# Altium project bridgeplusC.PrjPcb
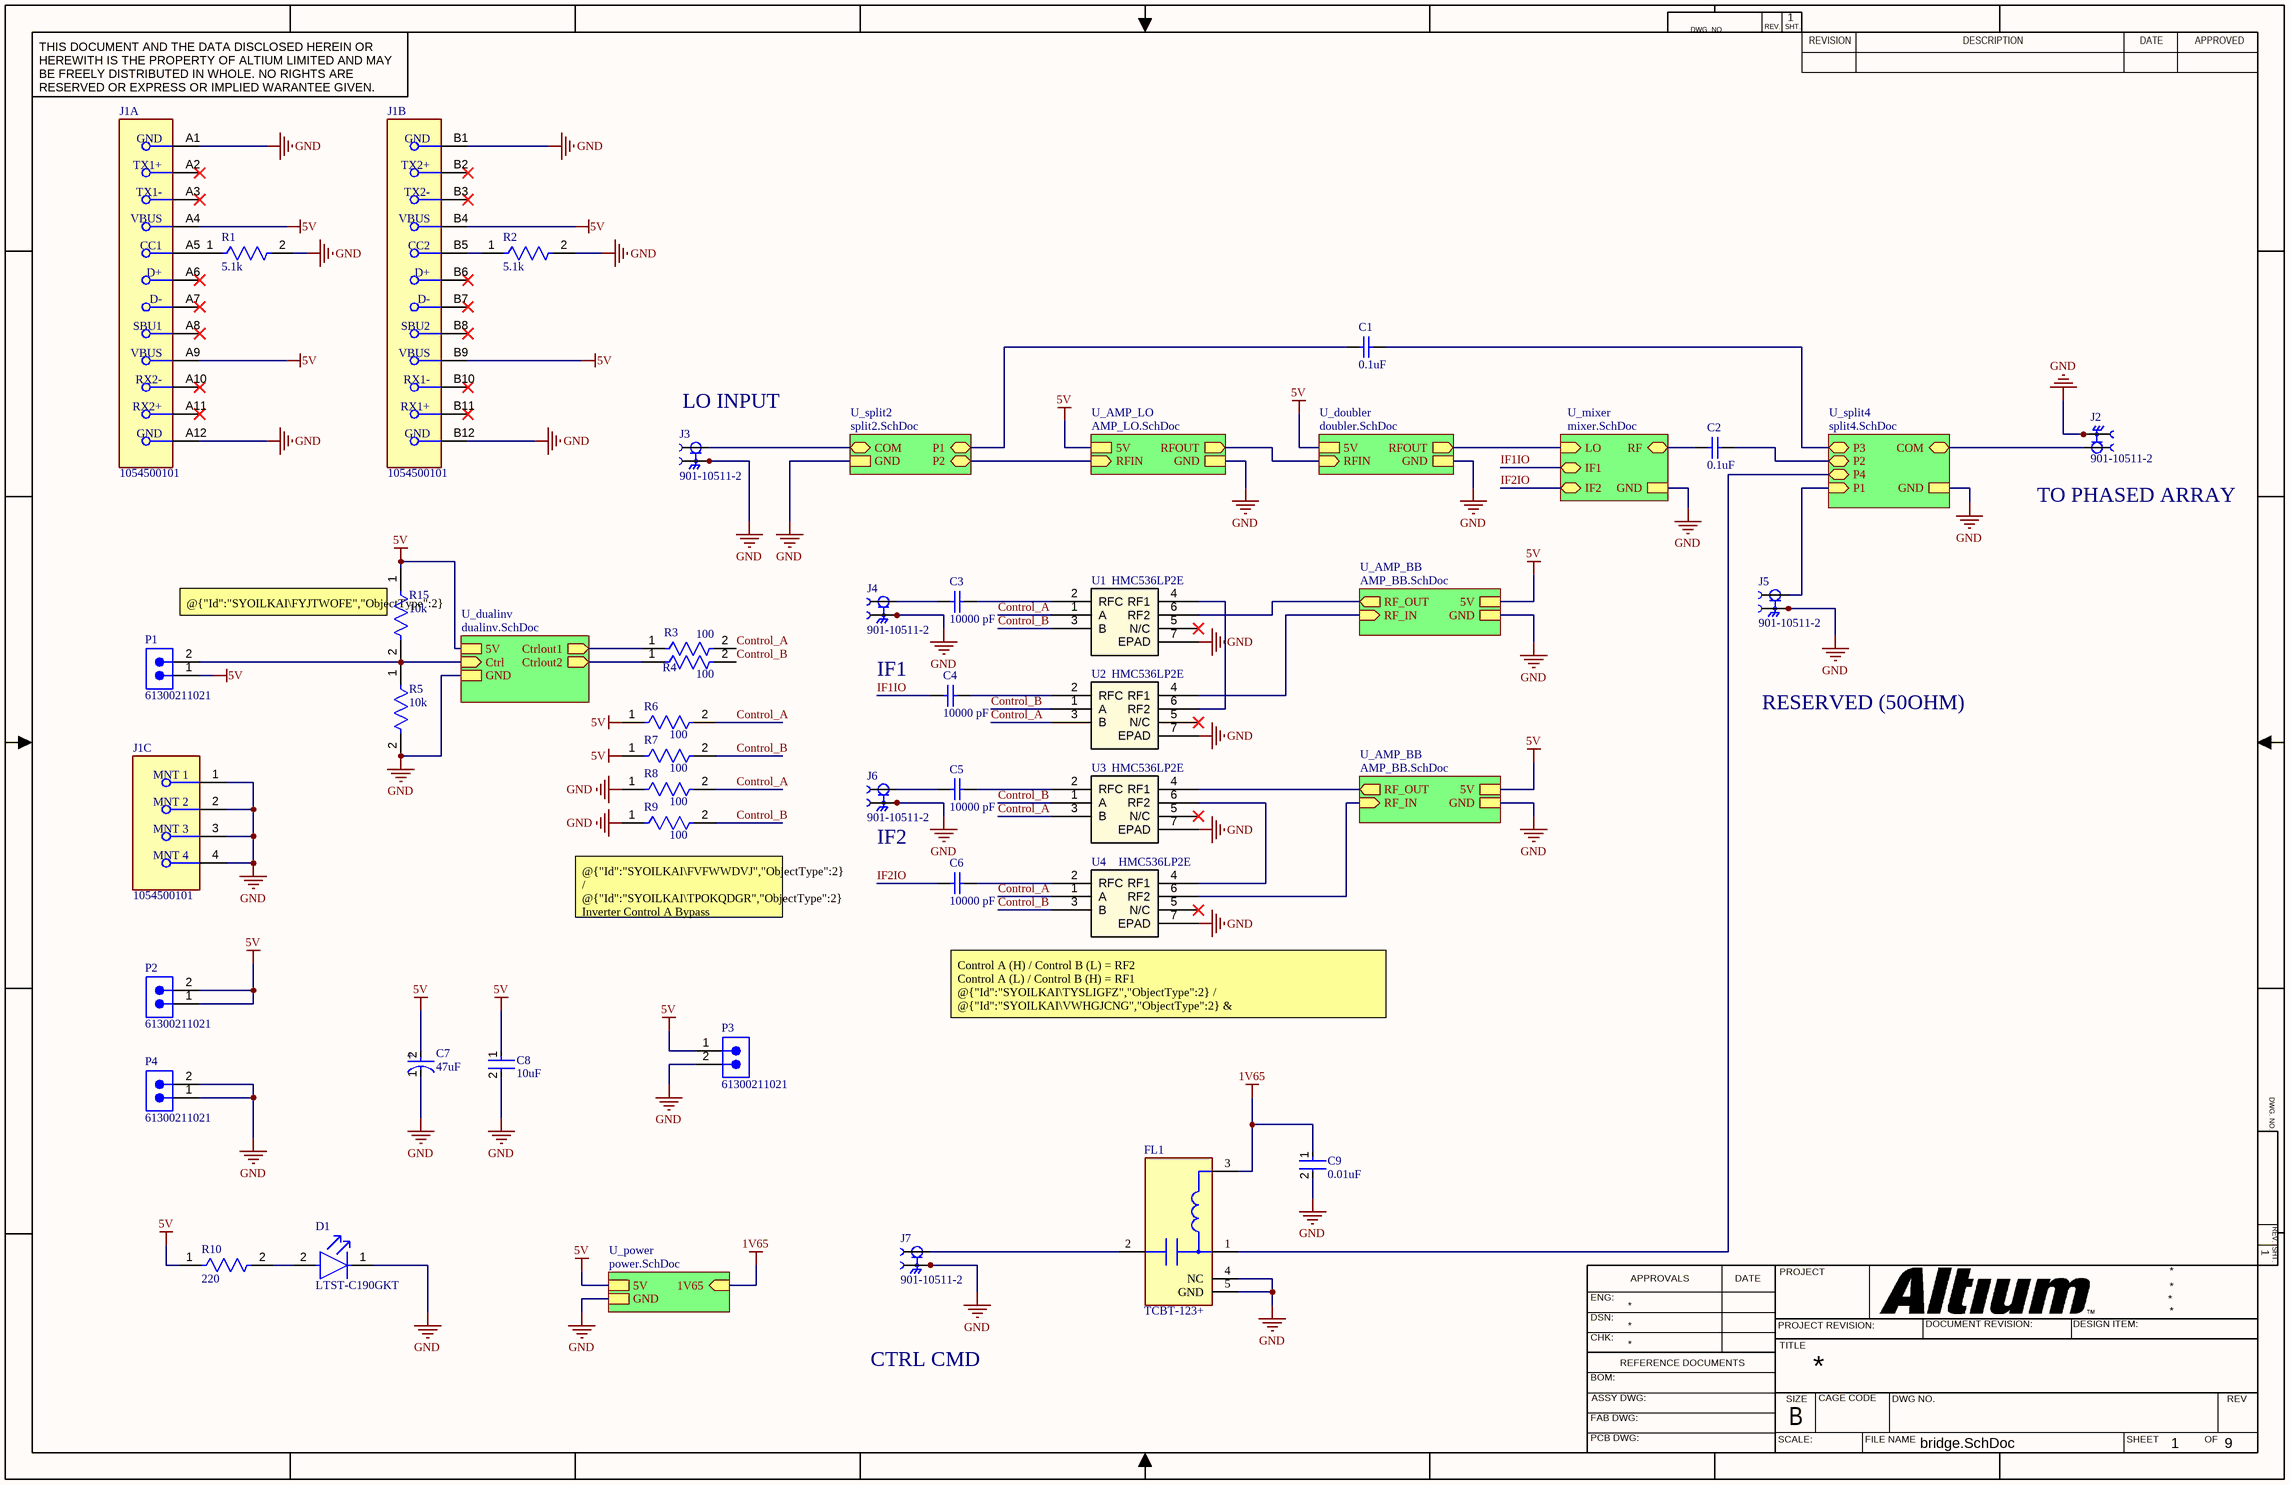
[diagram p0: bridge.SchDoc]
9 sheets, 75 parts. Net scope: strictly hierarchical (ports join the sheet entries above them; power ports are local).
Board file: BridgeC.PcbDoc
Sheets:
  bridge.SchDoc
    U_split2 = split2.SchDoc
    U_mixer = mixer.SchDoc
    U_split4 = split4.SchDoc
    U_AMP_LO = AMP_LO.SchDoc
    U_doubler = doubler.SchDoc
    U_power = power.SchDoc
    U_dualinv = dualinv.SchDoc
    U_AMP_BB = AMP_BB.SchDoc
    U_AMP_BB = AMP_BB.SchDoc

## Sheet bridge.SchDoc
size 431 x 279 mm; SheetNumber: 1; SheetTotal: 9

### Parts
C1  0.1uF  [CAPC0603X33X15LL03T05]
C2  0.1uF  [CAPC0603X33X15LL03T05]
C3  10000 pF  [CAPC1005X55X25ML05T10]
C4  10000 pF  [CAPC1005X55X25ML05T10]
C5  10000 pF  [CAPC1005X55X25ML05T10]
C6  10000 pF  [CAPC1005X55X25ML05T10]
C7  47uF  [FP-TAJB-MFG]
C8  10uF  [FP-ZRB18AR61E106ME01L-MFG]
C9  0.01uF  [FP-C0402-BB-MFG]
D1  LTST-C190GKT  [FP-LTST-C190GKT-MFG]
FL1  TCBT-123+  [FP-GU1414-MFG]
J1  1054500101  [FP-1054500101-MFG]  (parts A,B,C of 3)
J2  901-10511-2  [AMPHENOL_901-10511-2]
J3  901-10511-2  [AMPHENOL_901-10511-2]
J4  901-10511-2  [AMPHENOL_901-10511-2]
J5  901-10511-2  [AMPHENOL_901-10511-2]
J6  901-10511-2  [AMPHENOL_901-10511-2]
J7  901-10511-2  [AMPHENOL_901-10511-2]
P1  61300211021  [61300211021]
P2  61300211021  [61300211021]
P3  61300211021  [61300211021]
P4  61300211021  [61300211021]
R1  5.1k  [FP-CRCW0603-e3-IPC_C]
R2  5.1k  [FP-CRCW0603-e3-IPC_C]
R3  100  [FP-RC0603-0_55-MFG]
R4  100  [FP-RC0603-0_55-MFG]
R5  10k  [FP-RC0603-0_55-IPC_C]
R6  100  [FP-RC0603-0_55-MFG]
R7  100  [FP-RC0603-0_55-MFG]
R8  100  [FP-RC0603-0_55-MFG]
R9  100  [FP-RC0603-0_55-MFG]
R10  220  [FP-ERJ3G-MFG]
R15  10k  [FP-RC0603-0_55-IPC_C]
U1  HMC536LP2E  [HMC536LP2E]
U2  HMC536LP2E  [HMC536LP2E]
U3  HMC536LP2E  [HMC536LP2E]
U4  HMC536LP2E  [HMC536LP2E]

### Sub-sheets
U_AMP_BB = AMP_BB.SchDoc: RF_OUT (out), RF_IN (in), 5V, GND
U_AMP_BB = AMP_BB.SchDoc: RF_OUT (out), RF_IN (in), 5V, GND
U_AMP_LO = AMP_LO.SchDoc: GND, 5V, RFIN (in), RFOUT (out)
U_doubler = doubler.SchDoc: RFOUT (out), RFIN (in), GND, 5V
U_dualinv = dualinv.SchDoc: Ctrl (in), 5V, GND, Ctrlout1 (out), Ctrlout2 (out)
U_mixer = mixer.SchDoc: RF (bidir), GND, LO (in), IF1 (bidir), IF2 (bidir)
U_power = power.SchDoc: 5V, GND, 1V65 (in)
U_split2 = split2.SchDoc: COM (bidir), P1 (bidir), P2 (bidir), GND
U_split4 = split4.SchDoc: GND, P1 (in), P2 (bidir), P3 (bidir), P4 (bidir), COM (bidir)

### Nets
1V65: C9.1 FL1.3(DC) ; sheet U_power/1V65
5V: C7.2(A) C8.1 J1.A4(VBUS) J1.A9(VBUS) J1.B4(VBUS) J1.B9(VBUS) P1.1 P2.1 P2.2 P3.1 R6.1 R7.1 R10.1 R15.1 ; sheet U_AMP_LO/5V, sheet U_doubler/5V, sheet U_power/5V, sheet U_dualinv/5V, sheet U_AMP_BB/5V, sheet U_AMP_BB/5V  [project net +5]
GND: C7.1(C) C8.2 C9.2 D1.1(C) FL1.4(NC) FL1.5(GND) J1.1(MNT_1) J1.2(MNT_2) J1.3(MNT_3) J1.4(MNT_4) J1.A1(GND) J1.A12(GND) J1.B1(GND) J1.B12(GND) J2.G1 J2.G2 J3.G1 J3.G2 J4.G1 J4.G2 J5.G1 J5.G2 J6.G1 J6.G2 J7.G1 J7.G2 P3.2 P4.1 P4.2 R1.2 R2.2 R5.2 R8.1 R9.1 U1.7(EPAD) U2.7(EPAD) U3.7(EPAD) U4.7(EPAD) ; sheet U_split2/GND, sheet U_mixer/GND, sheet U_split4/GND, sheet U_AMP_LO/GND, sheet U_doubler/GND, sheet U_power/GND, sheet U_dualinv/GND, sheet U_AMP_BB/GND, sheet U_AMP_BB/GND
Control_A: R3.2 R6.2 R8.2 U1.1(A) U2.3(B) U3.3(B) U4.1(A)
Control_B: R4.2 R7.2 R9.2 U1.3(B) U2.1(A) U3.1(A) U4.3(B)
IF1IO: C4.1 ; sheet U_mixer/IF1
IF2IO: C6.1 ; sheet U_mixer/IF2
NetC1_1: C1.1 ; sheet U_split2/P1
NetC1_2: C1.2 ; sheet U_split4/P3
NetC2_1: C2.1 ; sheet U_mixer/RF
NetC2_2: C2.2 ; sheet U_split4/P2
NetC3_1: C3.1 J4.1
NetC3_2: C3.2 U1.2(RFC)
NetC4_2: C4.2 U2.2(RFC)
NetC5_1: C5.1 J6.1
NetC5_2: C5.2 U3.2(RFC)
NetC6_2: C6.2 U4.2(RFC)
NetC20_2: sheet U_AMP_LO/RFOUT, sheet U_doubler/RFIN
NetC23A_1: U2.4(RF1) ; sheet U_AMP_BB/RF_IN
NetC23B_1: U4.6(RF2) ; sheet U_AMP_BB/RF_IN
NetC24A_2: U1.6(RF2) ; sheet U_AMP_BB/RF_OUT
NetC24B_2: U3.4(RF1) ; sheet U_AMP_BB/RF_OUT
NetD1_2: D1.2(A) R10.2
NetFL1_1: FL1.1(RF&DC) ; sheet U_split4/P4
NetFL1_2: FL1.2(RF) J7.1
NetJ1_A5: J1.A5(CC1) R1.1
NetJ1_B5: J1.B5(CC2) R2.1
NetJ2_1: J2.1 ; sheet U_split4/COM
NetJ3_1: J3.1 ; sheet U_split2/COM
NetJ5_1: J5.1 ; sheet U_split4/P1
NetL2_1: sheet U_split2/P2, sheet U_AMP_LO/RFIN
NetP1_2: P1.2 R5.1 R15.2 ; sheet U_dualinv/Ctrl
NetR3_1: R3.1 ; sheet U_dualinv/Ctrlout1
NetR4_1: R4.1 ; sheet U_dualinv/Ctrlout2
NetU1_4: U1.4(RF1) U2.6(RF2)
NetU3_6: U3.6(RF2) U4.4(RF1)
NetU8_23: sheet U_mixer/LO, sheet U_doubler/RFOUT

Not connected (* = marked no-connect by the designer): J1 A2(TX1+)* A3(TX1-)* A6(D+)* A7(D-)* A8(SBU1)* A10(RX2-)* A11(RX2+)* B2(TX2+)* B3(TX2-)* B6(D+)* B7(D-)* B8(SBU2)* B10(RX1-)* B11(RX1+)*; U1 5(N/C)*; U2 5(N/C)*; U3 5(N/C)*; U4 5(N/C)*

### Notes on the sheet
- (near J3) LO INPUT
- (near J2) TO PHASED ARRAY
- (near R15) @{"Id":"SYOILKAI\FYJTWOFE","ObjectType":2} Pull-up DNI (Either @{"Id":"SYOILKAI\FYJTWOFE","ObjectType":2} | @{"Id":"SYOILKAI\KEMWNYXD","ObjectType":2} )
- IF1
- RESERVED (50OHM)
- (near J6) IF2
- (near R9) @{"Id":"SYOILKAI\FVFWWDVJ","ObjectType":2} / @{"Id":"SYOILKAI\TPOKQDGR","ObjectType":2} Inverter Control A Bypass
  @{"Id":"SYOILKAI\AHJBANLV","ObjectType":2} / @{"Id":"SYOILKAI\UMPLHLDU","ObjectType":2} Inverter Control B Bypass
  DNI Components.   Remove @{"Id":"SYOILKAI\ASZVIMTH","ObjectType":2} / @{"Id":"SYOILKAI\MEZSTMKU","ObjectType":2} to bypass
- (near U4) Control A (H) / Control B (L) = RF2
  Control A (L) / Control B (H) = RF1
  @{"Id":"SYOILKAI\TYSLIGFZ","ObjectType":2} / @{"Id":"SYOILKAI\VWHGJCNG","ObjectType":2} & @{"Id":"SYOILKAI\SXPUWDCE","ObjectType":2} / @{"Id":"SYOILKAI\PSJWTDBZ","ObjectType":2} Ctrl (L) --> Control A (H) / Control B (L) = AMP
  @{"Id":"SYOILKAI\TYSLIGFZ","ObjectType":2} / @{"Id":"SYOILKAI\VWHGJCNG","ObjectType":2} & @{"Id":"SYOILKAI\SXPUWDCE","ObjectType":2} / @{"Id":"SYOILKAI\PSJWTDBZ","ObjectType":2} Ctrl (H) --> Control A (L) / Control B (H) = Bypass
- CTRL CMD
- DWG. NO.
- REV.
- SHT.
- THIS DOCUMENT AND THE DATA DISCLOSED HEREIN OR HEREWITH IS THE PROPERTY OF ALTIUM LIMITED AND MAY BE FREELY DISTRIBUTED IN WHOLE. NO RIGHTS ARE RESERVED OR EXPRESS OR IMPLIED WARANTEE GIVEN.
- REVISION
- DESCRIPTION
- DATE
- APPROVED
- ENG:
- APPROVALS
- PROJECT
- DSN:
- CHK:
- REFERENCE DOCUMENTS
- PROJECT REVISION:
- TITLE
- DOCUMENT REVISION:
- DESIGN ITEM:
- BOM:
- FAB DWG:
- PCB DWG:
- ASSY DWG:
- SCALE:
- SIZE
- B
- CAGE CODE
- FILE NAME
- DWG NO.
- SHEET
- OF
- REV
- (in symbol CMP-04424-000629-1) +

### Library data of the parts
C1 C2 = CMP-2010-00245-1: CAP CER 0.1UF 16V X5R 0201, Broadband / Multilayer Capacitor; Manufacturer: KYOCERA AVX; Part Number: 531Z104KT16T; Supplier 1: Mouser; Supplier Part Number 1: 581-531Z104KT16T
C3-C6 = CNP-CAP-10000PF-RF: CAP CER 10000PF 16V X7R 0402, RF Series; Manufacturer: KYOCERA AVX; Part Number: 520L103KT16T; Supplier 1: Mouser; Supplier Part Number 1: 81-RDER72H473K2K1H3B
C7 = CMP-04424-000629-1: 47uF 10V  ±10% 1Ω 1210  SMD Tantalum Capacitor; Part Number: TAJB476K010RNJ; Manufacturer: KYOCERA AVX; Leakage Current: 4.7uA; ESR (Equivalent Series Resistance): 1R; Dissipation Factor: 8%; Polarity: Polar; Package Quantity: 1; Length: 3.5mm; Dielectric Material: Tantalum; Series: TAJ; Termination: SMD/SMT; Case Code (Metric): 3528; Case Code (Imperial): 1210; Height - Seated (Max): 0.083inch; Lead Pitch: 1.4mm; Features: General Purpose; Radiation Hardening: No; Lead Free: Lead Free; Construction: Flat; RoHS Compliant: Yes; Case/Package: 1210; Min Operating Temperature: -55°C; Voltage: 10V; Depth: 2.8mm; Mount: Surface Mount; REACH SVHC: No SVHC; Width: 0.11inch; Voltage Rating (DC): 10V; Max Operating Temperature: 125°C; Capacitance: 47uF; Tolerance: 10%; Voltage Rating: 10V; Packaging: Tape and Reel; Number of Pins: 2; Height: 1.9mm; Supplier 1: Future Electronics; Supplier Part Number 1: 7241805
C8 = CMP-06035-062385-2: CAP CER 10UF 25V X5R 0603; Part Number: ZRB18AR61E106ME01L; Manufacturer: Murata; Tolerance: 20%; Min Operating Temperature: -55°C; Voltage: 25V; Case Code (Imperial): 0603; Case Code (Metric): 1608; Voltage Rating (DC): 25V; Max Operating Temperature: 85°C; Depth: 0.8mm; Thickness: 0.047inch; RoHS Compliant: Yes; Dielectric: X5R; Mount: Surface Mount; Voltage Rating: 25V; Length: 0.063inch; Height: 1mm; Packaging: Cut Tape; Capacitance: 10uF; REACH SVHC: No SVHC; Width: 0.031inch; Case/Package: 0603; Supplier 1: Arrow Electronics; Supplier Part Number 1: ZRB18AR61E106ME01L
C9 = CMP-2008-02109-2: CAP CER 10000PF 50V X7R 0402; Manufacturer: Murata; Manufacturer Part Number: GCM155R71H103KA55D; Tolerance: 0.1; Value: 10,000 pF; Material: Ceramic; Height: 0.55mm; Temperature Range Low: -55°C; ComponentLink2URL: https://content.kemet.com/datasheets/KEM_C1002_X7R_SMD.pdf; Temperature Characteristic: X7R; Automotive: No; Device Class L2: Capacitors; ComponentLink2Description: Datasheet; Voltage Rating: 50 V; Capacitance: 10,000 pF; Temperature: -55°C to +125°C; Part Number: GCM155R71H103KA55D; Supplier 1: Arrow Electronics; Supplier Part Number 1: GCM155R71H103KA55D
D1 = CMP-22017-000005-2: LED GREEN CLEAR CHIP SMD; Manufacturer: Lite-On; Dominant Wavelength: 569nm; Reverse Voltage: 5V; Lens Color: Colorless; Viewing Angle: 130°; Voltage: 2V; Forward Current: 30mA; Power Dissipation: 100mW; Luminous Intensity: 6mcd; Number of LEDs: 1; Forward Voltage: 2.1V; Wavelength: 565nm; Test Current: 10mA; Min Operating Temperature: -55°C; Lens Style: Clear; Mount: Surface Mount; Width: 0.8mm; Packaging: Tape and Reel; Lens Transparency: Clear; Case Code (Metric): 1608; Depth: 0.8mm; Case Code (Imperial): 0603; Case/Package: 0603; Number of Pins: 2; Max Operating Temperature: 85°C; Lead Free: Lead Free; Number of Elements: 1; Length: 1.6mm; Height: 0.8mm; Package Quantity: 1; Power Rating: 100mW; Radiation Hardening: No; Illumination Color: Green; Color: Green; Part Number: LTST-C190GKT; Supplier 1: Digikey; Supplier Part Number 1: 160-1183-1-ND
FL1 = CMP-01968-107855816-1: TCBT-123+ OEMs, CMs ONLY (NO BROKERS), / BIAS TEE SMT, 10 MHZ - 12 GHZ, 5; Manufacturer: Mini-Circuits; Min Operating Temperature: -40°C; Height: 3.81mm; Max Operating Temperature: 85°C; Part Number: TCBT-123+
J1 = CMP-04767-000004-1: CONN RCP USB3.1 TYPEC 24P SMD RA; Manufacturer: Molex; Number Of Contacts: 24; Voltage Rating: 30V; Shielding: true; Is Female: yes; Current Rating: 0.25/1.25/5A; Pitch: 0.5mm; Conn Orientation: Right Angle; Package: 0; Height: 3.44mm; Footprint Url: https://www.molex.com/pdm_docs/sd/1054500101_sd.pdf; Device Class L1: Connectors; Category: Conn; Device Class L2: USB Connectors; Digikey Description: CONN RCP USB3.1 TYPEC 24P SMD RA; Contact Material: Gold,Nickel; Mouser Description: USB Shielded I/O Receptacle; Type C; Right Angle; Surface Mount; Gold over Nickel; ComponentLink2Description: Datasheet; Lead Free: Yes; Automotive: No; Temperature Range High: +85°C; RoHS: TRUE; ComponentLink2URL: https://www.molex.com/webdocs/datasheets/pdf/en-us/1054500101_IO_CONNECTORS.pdf; Temperature: -30°C to +85°C; Usb Standard: USB 3.1; Temperature Range Low: -30°C; Manufacturer Part Number: 1054500101; Part Number: 1054500101; Supplier 1: Arrow Electronics; Supplier Part Number 1: 105450-0101
J2-J7 = 901-10511-2: SMA Straight End Launch Jack, .010 Pin, .068  PCB, Edge-Mount, High Frequency | Amphenol RF 901-10511-2; Manufacturer: Amphenol RF; Part Number: 901-10511-2; Supplier 1: Avnet; Supplier Part Number 1: 99Y7069
P1-P4 = CMP-1502-01059-3: CONN HEADER R/A 2POS 2.54MM; NexarPartId: 32855519; Manufacturer: Wurth; Gender: Male; Contact Resistance: 20mΩ; Operating Supply Voltage: 250V; Connector Type: Male Pin; Current Rating: 3A; Number of Contacts: 2; Termination: Solder; Number of Pins: 2; Number of Rows: 1; Contact Plating: Gold; Contact Material: Copper; REACH SVHC: Unknown; Mount: Through Hole; RoHS: Compliant; Color: Black; Packaging: Bulk; Pitch: 2.54mm; Contact Mating Length: 5.9944mm; Number of Positions: 2; Lead Pitch: 2.54mm; Part Number: 61300211021; Supplier 1: Digikey; Supplier Part Number 1: 732-5335-ND
R1 R2 = CMP-1012-00590-3: RES Thick Film, 5.1kΩ, 1%, 0.1W, 100ppm/°C, 0603; Part Number: ERJ-3EKF5101V; Manufacturer: Panasonic; Power Rating: 100mW; Voltage Rating (DC): 75V; Resistance: 5.1kR; Width: 0.85mm; Depth: 0.85mm; Military Standard: Not; Package Quantity: 5000; Case Code (Metric): 1608; Length: 1.55mm; Weight: 7.1E-05oz; Packaging: Tape and Reel; Temperature Coefficient: 100ppm/°C; Case Code (Imperial): 0603; Lead Free: Lead Free; Radiation Hardening: No; Contact Plating: Tin; Composition: Thick Film; Max Operating Temperature: 155°C; Termination: SMD/SMT; Case/Package: 0603; Min Operating Temperature: -55°C; Tolerance: 1%; Voltage Rating: 75V; Mount: Surface Mount; Height: 0.45mm; Supplier 1: Mouser; Supplier Part Number 1: 667-ERJ-3EKF5101V
R3 R4 R6-R9 = CMP-2000-05021-2: RES SMD 100 OHM 5% 1/10W 0603; Manufacturer: Panasonic; Part Number: ERJ-3GEYJ101V; Temperature Coefficient: 100ppm/°C; Voltage Rating (DC): 50V; Power Rating: 100mW; Resistance: 100R; Features: Moisture Resistant; Width: 0.8mm; RoHS Compliant: Yes; Series: RC; Case Code (Metric): 1608; Packaging: Tape and Reel; Construction: Rectangular; Contact Plating: Tin; Resistor Type: Thick Film; Case/Package: 0603; Military Standard: Not; Case Code (Imperial): 0603; Number of Pins: 2; Length: 1.6mm; Size Code: 0603; Voltage Rating: 50V; Min Operating Temperature: -55°C; Max Power Dissipation: 100mW; Tolerance: 5%; Lead Free: Lead Free; Termination: SMD/SMT; Resistance Tolerance: 5%; Depth: 0.8mm; Max Operating Temperature: 155°C; Number of Terminations: 2; Radiation Hardening: No; Supplier 1: Mouser; Supplier Part Number 1: 667-ERJ-3GEYJ101V
R5 R15 = CMP-2100-03664-2: RES 10K OHM 1% 1/10W 0603; Part Number: ERJ-S03F1002V; Manufacturer: Panasonic; Voltage Rating: 75V; Voltage Rating (DC): 50V; Resistance: 10kR; Power Rating: 100mW; Temperature Coefficient: 100ppm/°C; Depth: 0.8mm; Termination: SMD/SMT; Resistor Type: Thick Film; Series: RC; Construction: Rectangular; Features: Moisture Resistant; Packaging: Tape and Reel; Min Operating Temperature: -55°C; Number of Terminations: 2; Lead Pitch: 0.3mm; RoHS Compliant: Yes; Case/Package: 0603; Resistance Tolerance: 1%; Military Standard: Not; Weight: 7.1E-05oz; Number of Pins: 2; Tolerance: 1%; Length: 1.6mm; Case Code (Imperial): 0603; Lead Free: Lead Free; Width: 0.8mm; Max Power Dissipation: 100mW; Height: 0.45mm; Max Operating Temperature: 155°C; Case Code (Metric): 1608; Size Code: 0603; Supplier 1: Mouser; Supplier Part Number 1: 667-ERJ-S03F1002V
R10 = CMP-2000-00746-2: RES SMD 220 OHM 5% 1/10W 0603; Manufacturer: Panasonic; Part Number: ERJ-3GEYJ221V; Max Power Dissipation: 100mW; Voltage Rating (DC): 50V; Temperature Coefficient: 200ppm/°C; Voltage Rating: 75V; Resistance: 220R; Height: 0.45mm; Case Code (Metric): 1608; Mount: Surface Mount; Military Standard: Not; Contact Plating: Tin; Radiation Hardening: No; Technology: THICK FILM; Case Code (Imperial): 0603; Features: Automotive AEC-Q200; Tolerance: 5%; Lead Free: Lead Free; Width: 0.031inch; Weight: 7.1E-05oz; Max Operating Temperature: 155°C; Case/Package: 0603; Series: ERJ; Package Quantity: 1; Number of Terminations: 2; Construction: Rectangular; Packaging: Tape and Reel; REACH SVHC: No SVHC; Min Operating Temperature: -55°C; Resistor Type: Thick Film; Length: 1.6mm; Power Rating: 100mW; Depth: 0.8mm; Resistance Tolerance: 5%; Termination: SMD/SMT; RoHS Compliant: Yes; Supplier 1: Future Electronics; Supplier Part Number 1: 4042422
U1-U4 = HMC536LP2E: IC RF SWITCH SPDT 6GHZ 6DFN; Manufacturer: Analog Devices; Part Number: HMC536LP2E; Supplier 1: Mouser; Supplier Part Number 1: 584-HMC536LP2E

## Sheet split2.SchDoc
size A; SheetNumber: 3; SheetTotal: 9
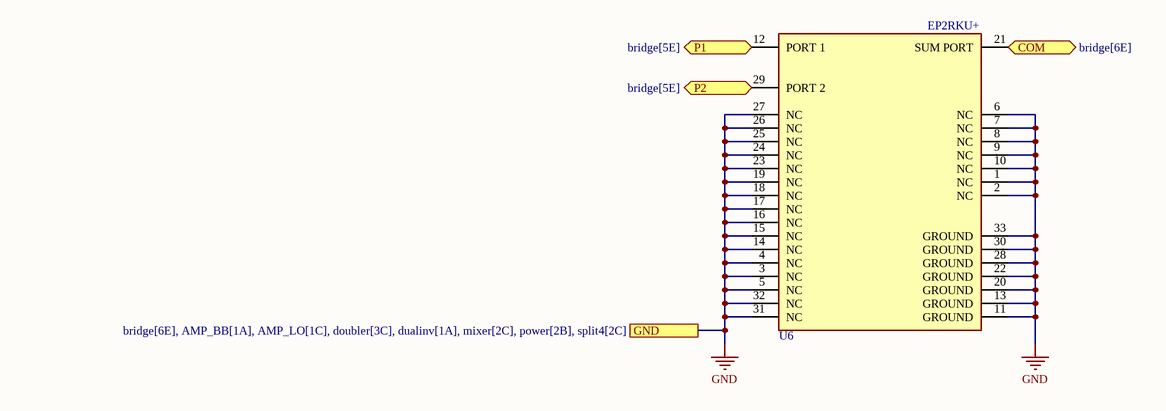
[diagram p1: split2.SchDoc]

### Parts
U6  EP2RKU+  [EP2RKU+]

### Ports
COM (bidir, see bridge[6E]), GND (see bridge[6E], AMP_BB[1A], AMP_LO[1C], doubler[3C], dualinv[1A], mixer[2C], power[2B], split4[2C]), P1 (bidir, see bridge[5E]), P2 (bidir, see bridge[5E])

### Nets
GND: U6.1(NC) U6.2(NC) U6.3(NC) U6.4(NC) U6.5(NC) U6.6(NC) U6.7(NC) U6.8(NC) U6.9(NC) U6.10(NC) U6.11(GROUND) U6.13(GROUND) U6.14(NC) U6.15(NC) U6.16(NC) U6.17(NC) U6.18(NC) U6.19(NC) U6.20(GROUND) U6.22(GROUND) U6.23(NC) U6.24(NC) U6.25(NC) U6.26(NC) U6.27(NC) U6.28(GROUND) U6.30(GROUND) U6.31(NC) U6.32(NC) U6.33(GROUND) ; port GND
NetC1_1: U6.12(PORT_1) ; port P1
NetJ3_1: U6.21(SUM_PORT) ; port COM
NetL2_1: U6.29(PORT_2) ; port P2

### Library data of the parts
U6 = EP2RKU+: 2 Ways MMIC Power Splitter, DC - 18000 MHz, 50Ω; Manufacturer: Mini-Circuits; Part Number: EP2RKU+; Supplier 1: Digikey; Supplier Part Number 1: 3157-EP2RKU+CT-ND

## Sheet mixer.SchDoc
size A; SheetNumber: 5; SheetTotal: 9
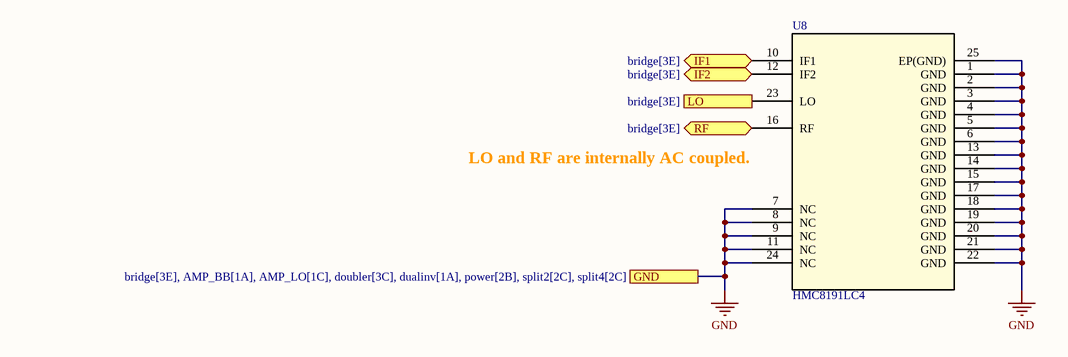
[diagram p2: mixer.SchDoc]

### Parts
U8  HMC8191LC4  [HMC8191_E-24-1]

### Ports
GND (see bridge[3E], AMP_BB[1A], AMP_LO[1C], doubler[3C], dualinv[1A], power[2B], split2[2C], split4[2C]), IF1 (bidir, see bridge[3E]), IF2 (bidir, see bridge[3E]), LO (in, see bridge[3E]), RF (bidir, see bridge[3E])

### Nets
GND: U8.1(GND) U8.2(GND) U8.3(GND) U8.4(GND) U8.5(GND) U8.6(GND) U8.7(NC) U8.8(NC) U8.9(NC) U8.11(NC) U8.13(GND) U8.14(GND) U8.15(GND) U8.17(GND) U8.18(GND) U8.19(GND) U8.20(GND) U8.21(GND) U8.22(GND) U8.24(NC) U8.25(EP(GND)) ; port GND
IF1IO: U8.10(IF1) ; port IF1
IF2IO: U8.12(IF2) ; port IF2
NetC2_1: U8.16(RF) ; port RF
NetU8_23: U8.23(LO) ; port LO

### Notes on the sheet
- (near U8) LO and RF are internally AC coupled.

### Library data of the parts
U8 = HMC8191LC4: 6 GHz to 26.5 GHz, / Wideband I/Q Mixer; Manufacturer: Analog Devices; RefDes: RefDes; Supplier 1: Mouser; Supplier Part Number 1: 584-HMC8191LC4; Part Number: HMC8191LC4

## Sheet split4.SchDoc
size A; SheetNumber: 4; SheetTotal: 9
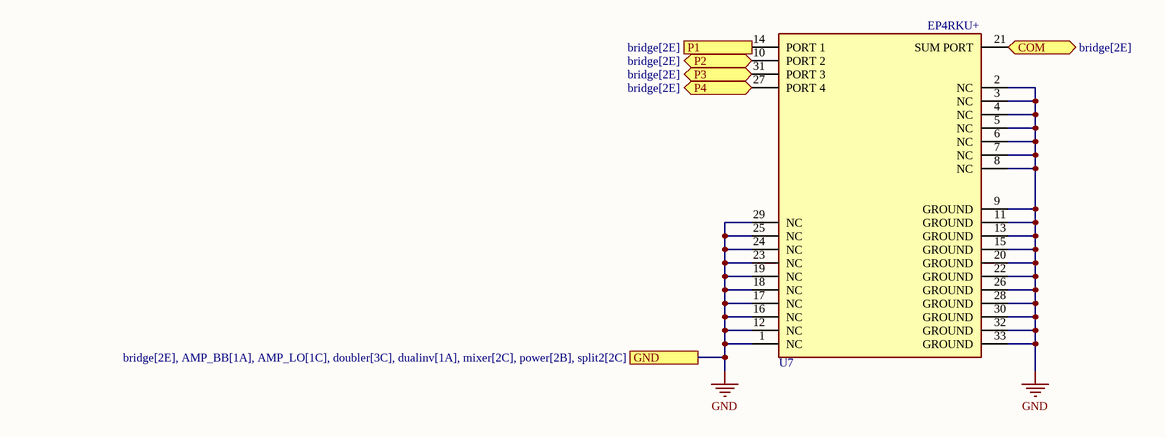
[diagram p3: split4.SchDoc]

### Parts
U7  EP4RKU+  [EP4RKU+]

### Ports
COM (bidir, see bridge[2E]), GND (see bridge[2E], AMP_BB[1A], AMP_LO[1C], doubler[3C], dualinv[1A], mixer[2C], power[2B], split2[2C]), P1 (in, see bridge[2E]), P2 (bidir, see bridge[2E]), P3 (bidir, see bridge[2E]), P4 (bidir, see bridge[2E])

### Nets
GND: U7.1(NC) U7.2(NC) U7.3(NC) U7.4(NC) U7.5(NC) U7.6(NC) U7.7(NC) U7.8(NC) U7.9(GROUND) U7.11(GROUND) U7.12(NC) U7.13(GROUND) U7.15(GROUND) U7.16(NC) U7.17(NC) U7.18(NC) U7.19(NC) U7.20(GROUND) U7.22(GROUND) U7.23(NC) U7.24(NC) U7.25(NC) U7.26(GROUND) U7.28(GROUND) U7.29(NC) U7.30(GROUND) U7.32(GROUND) U7.33(GROUND) ; port GND
NetC1_2: U7.31(PORT_3) ; port P3
NetC2_2: U7.10(PORT_2) ; port P2
NetFL1_1: U7.27(PORT_4) ; port P4
NetJ2_1: U7.21(SUM_PORT) ; port COM
NetJ5_1: U7.14(PORT_1) ; port P1

### Library data of the parts
U7 = EP4RKU+: Power Splitter/Combiner 4 Way-0° 50Ω DC to 18 GHz; Manufacturer: Mini-Circuits; Part Number: EP4RKU+; Supplier 1: Digikey; Supplier Part Number 1: 3157-EP4RKU+CT-ND

## Sheet AMP_LO.SchDoc
size A; SheetNumber: 7; SheetTotal: 9
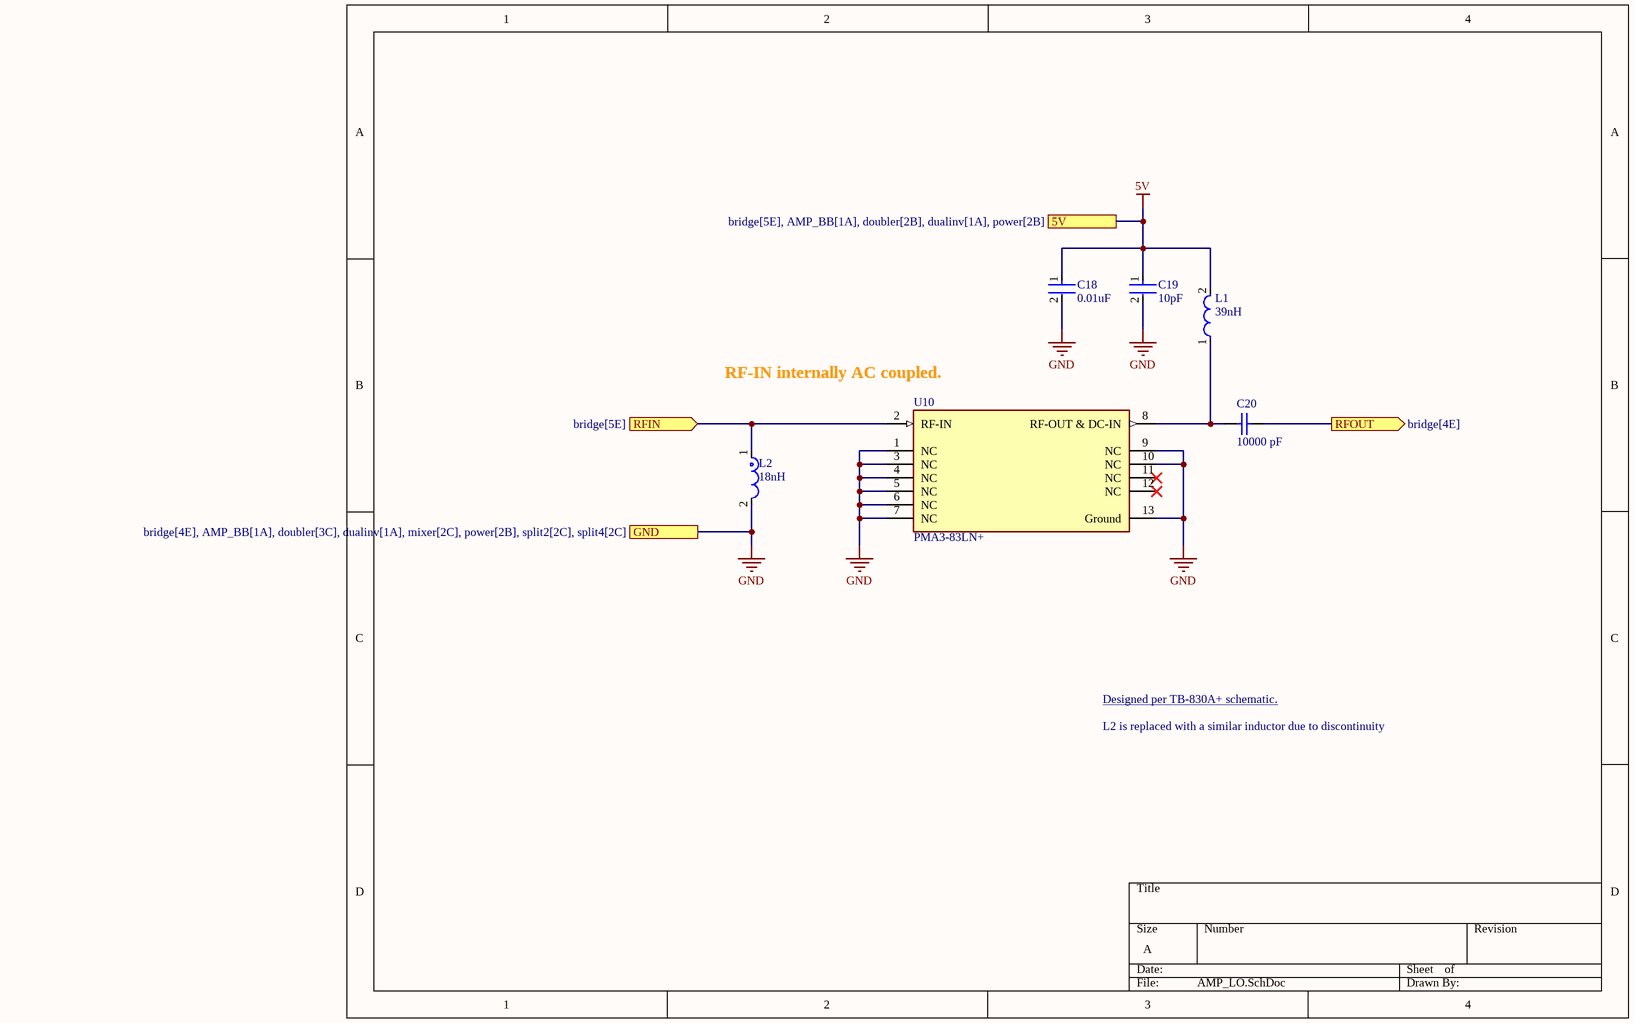
[diagram p4: AMP_LO.SchDoc]

### Parts
C18  0.01uF  [FP-C0402-BB-MFG]
C19  10pF  [FP-GJM155-0_05-IPC_A]
C20  10000 pF  [CAPC1005X55X25ML05T10]
L1  39nH  [FP-LQW15AN_00-W0_5-0_1-MFG]
L2  18nH  [FP-LQG15HH_02-MFG]
U10  PMA3-83LN+  [FP-DQ1225-MFG]

### Ports
5V (see bridge[5E], AMP_BB[1A], doubler[2B], dualinv[1A], power[2B]), GND (see bridge[4E], AMP_BB[1A], doubler[3C], dualinv[1A], mixer[2C], power[2B], split2[2C], split4[2C]), RFIN (in, see bridge[5E]), RFOUT (out, see bridge[4E])

### Nets
5V: C18.1 C19.1 L1.2 ; port 5V  [project net +5]
GND: C18.2 C19.2 L2.2 U10.1(NC) U10.3(NC) U10.4(NC) U10.5(NC) U10.6(NC) U10.7(NC) U10.9(NC) U10.10(NC) U10.13(Ground) ; port GND
NetC20_1: C20.1 L1.1 U10.8(RF-OUT_&_DC-IN)
NetC20_2: C20.2 ; port RFOUT
NetL2_1: L2.1 U10.2(RF-IN) ; port RFIN

Not connected (* = marked no-connect by the designer): U10 11(NC)* 12(NC)*

### Notes on the sheet
- (near U10) RF-IN internally AC coupled.
- Designed per TB-830A+ schematic. <https://www.minicircuits.com/pdfs/PMA3-83LN+.pdf>
- L2 is replaced with a similar inductor due to discontinuity

### Library data of the parts
C18 = CMP-2008-02109-2: CAP CER 10000PF 50V X7R 0402; Manufacturer: Murata; Part Number: GCM155R71H103KA55D; Tolerance: 0.1; Value: 10,000 pF; Material: Ceramic; Supplier 1: Arrow Electronics; Supplier Part Number 1: GCM155R71H103KA55D; Height: 0.55mm; Manufacturer Part Number: GCM155R71H103KA55D; Temperature Range Low: -55°C; ComponentLink2URL: https://content.kemet.com/datasheets/KEM_C1002_X7R_SMD.pdf; Temperature Characteristic: X7R; Automotive: No; Device Class L2: Capacitors; ComponentLink2Description: Datasheet; Voltage Rating: 50 V; Capacitance: 10,000 pF; Temperature: -55°C to +125°C
C19 = CMP-2008-03797-2: Multi-Layer Ceramic Capacitor 10pF C0G  ±5% 0402 Paper T/R; Manufacturer: Murata; Part Number: GJM1555C1H100JB01D; Voltage Rating (DC): 50V; Mount: Surface Mount; Width: 0.02inch; Height: 0.5mm; Termination: SMD/SMT; Capacitance: 10pF; Packaging: Tape and Reel; Case Code (Metric): 1005; Depth: 0.5mm; Min Operating Temperature: -55°C; Case/Package: 0402; Voltage Rating: 50V; Tolerance: 5%; Lead Free: Lead Free; Package Quantity: 1; Case Code (Imperial): 0402; Radiation Hardening: No; Length: 1mm; Voltage: 50V; Dielectric: C0G; Thickness: 0.022inch; Max Operating Temperature: 125°C; Supplier 1: Arrow Electronics; Supplier Part Number 1: GJM1555C1H100JB01D
C20 = CNP-CAP-10000PF-RF: as C3 on sheet bridge; Supplier 1: Mouser; Supplier Part Number 1: 81-RDER72H473K2K1H3B
L1 = CMP-06042-002147-1: Wire Wound RF Inductor 39nH ±2% 250mA 0.7Ω 0402 (1005); Part Number: LQW15AN39NG00D; Manufacturer: Murata; Core Material: Air; Shielding: Unshielded; Test Frequency: 100MHz; Self Resonant Frequency: 3GHz; DC Resistance (DCR): 700mR; Current: 750mA; Q Factor: 25; Lead Free: Lead Free; Case/Package: 0402; Packaging: Tape and Reel; Inductance: 39nH; Height: 0.5mm; Tolerance: 2%; Max Operating Temperature: 125°C; Max DC Current: 250mA; Case Code (Metric): 1005; REACH SVHC: No SVHC; Number of Pins: 2; Radiation Hardening: No; Military Standard: Not; Min Operating Temperature: -55°C; Termination: SMD/SMT; Inductance Tolerance: 2%; Mount: Surface Mount; Case Code (Imperial): 0402; Package Quantity: 1; DC Current: 250mA; Depth: 0.6mm; Weight: 2.8E-05oz; Width: 0.5mm; Current Rating: 250mA; Length: 1mm; Supplier 1: Arrow Electronics; Supplier Part Number 1: LQW15AN39NG00D
L2 = CMP-06042-000668-1: Multilayer type RF Inductor 18nH ±5% 0.36Ω 400mA 0402; Part Number: LQG15HS18NJ02D; Manufacturer: Murata; DC Current: 300mA; Test Frequency: 100MHz; Self Resonant Frequency: 2.2GHz; Shielding: Unshielded; Core Material: Air; DC Resistance (DCR): 360mR; Q Factor: 8; Inductance: 18nH; Military Standard: Not; REACH SVHC: No SVHC; Tolerance: 5%; Inductance Tolerance: 5%; Weight: 2.3E-05oz; Lead Free: Lead Free; Depth: 0.55mm; Current Rating: 300mA; Max DC Current: 300mA; Max Operating Temperature: 125°C; Length: 0.039inch; Min Operating Temperature: -55°C; Width: 0.5mm; Radiation Hardening: No; Termination: SMD/SMT; Height: 0.5mm; Package Quantity: 10000; Packaging: Tape and Reel; Case/Package: 0402; Case Code (Imperial): 0402; Mount: Surface Mount; Height - Seated (Max): 0.022inch; Case Code (Metric): 1005; Supplier 1: Arrow Electronics; Supplier Part Number 1: LQG15HS18NJ02D
U10 = CMP-199891-000002-1: SMT LOW NOISE AMPLIFIER, 500 - 8; Manufacturer: Mini-Circuits; Part Number: PMA3-83LN+; Supplier 1: Digikey; Supplier Part Number 1: 3157-PMA3-83LN+CT-ND

## Sheet doubler.SchDoc
size A; SheetNumber: 6; SheetTotal: 9
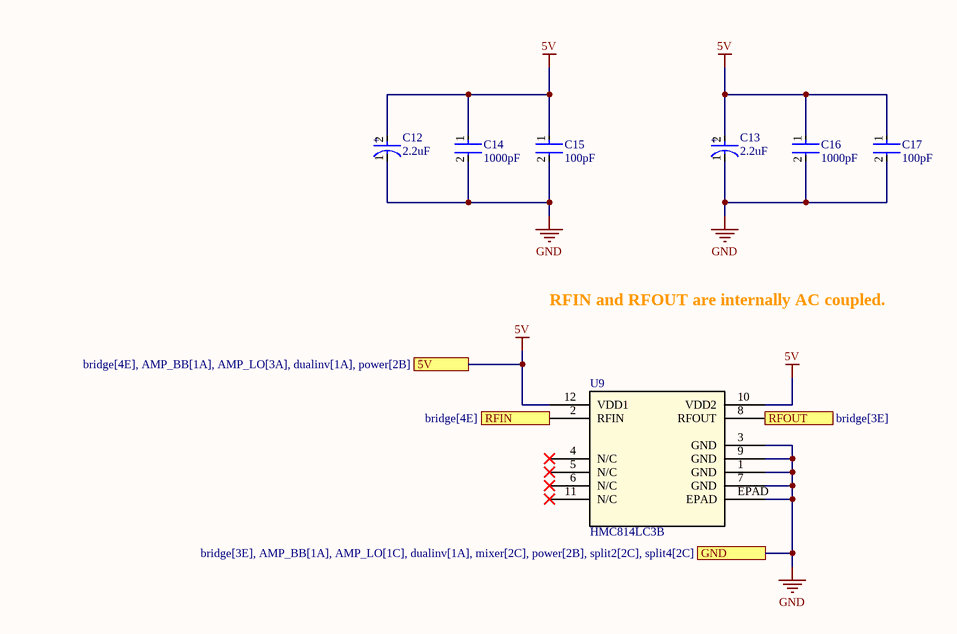
[diagram p5: doubler.SchDoc]

### Parts
C12  2.2uF  [FP-TAJA-MFG]
C13  2.2uF  [FP-TAJA-MFG]
C14  1000pF  [FP-C0603C-CF-MFG]
C15  100pF  [FP-CL05-MFG]
C16  1000pF  [FP-C0603C-CF-MFG]
C17  100pF  [FP-CL05-MFG]
U9  HMC814LC3B  [HCP_12_1]

### Ports
5V (see bridge[4E], AMP_BB[1A], AMP_LO[3A], dualinv[1A], power[2B]), GND (see bridge[3E], AMP_BB[1A], AMP_LO[1C], dualinv[1A], mixer[2C], power[2B], split2[2C], split4[2C]), RFIN (in, see bridge[4E]), RFOUT (out, see bridge[3E])

### Nets
5V: C12.2(A) C13.2(A) C14.1 C15.1 C16.1 C17.1 U9.10(VDD2) U9.12(VDD1) ; port 5V  [project net +5]
GND: C12.1(C) C13.1(C) C14.2 C15.2 C16.2 C17.2 U9.1(GND) U9.3(GND) U9.7(GND) U9.9(GND) U9.EPAD ; port GND
NetC20_2: U9.2(RFIN) ; port RFIN
NetU8_23: U9.8(RFOUT) ; port RFOUT

Not connected (* = marked no-connect by the designer): U9 4(N/C)* 5(N/C)* 6(N/C)* 11(N/C)*

### Notes on the sheet
- RFIN and RFOUT are internally AC coupled.
- (in symbol CMP-04424-000432-1) +

### Library data of the parts
C12 C13 = CMP-04424-000432-1: 2.2uF 16V  ±10% 6.5Ω 1206  SMD Tantalum Capacitor; Manufacturer: KYOCERA AVX; Part Number: TAJA225K016RNJ; Polarity: Polar; Leakage Current: 500nA; Dissipation Factor: 6%; ESR (Equivalent Series Resistance): 6.5R; Q Factor: 6; Series: TAJ; Number of Pins: 2; Termination: SMD/SMT; Construction: Flat; Min Operating Temperature: -55°C; Capacitance: 2.2uF; Voltage Rating: 16V; Dielectric Material: Tantalum; Radiation Hardening: No; Package Quantity: 1; Depth: 1.6mm; Features: General Purpose; Max Operating Temperature: 125°C; Height: 1.6mm; Height - Seated (Max): 0.071inch; Tolerance: 10%; Voltage Rating (DC): 16V; Width: 1.6mm; Mount: Surface Mount; Packaging: Tape and Reel; Lead Free: Lead Free; RoHS Compliant: Yes; Length: 3.2mm; Case/Package: 1206; REACH SVHC: No SVHC; Case Code (Metric): 3216; Case Code (Imperial): 1206; Voltage: 16V; Supplier 1: Future Electronics; Supplier Part Number 1: 1352210
C14 C16 = CMP-2006-03022-3: CAP CER 1000PF 50V C0G/NP0 0603; Manufacturer: Murata; Part Number: GRM1885C1H102JA01D; Value: 1,000 pF; Material: Ceramic; ComponentLink2URL: https://api.kemet.com/component-edge/download/datasheet/C0603C100J5GACAUTO.pdf; Capacitance: 1,000 pF; Temperature Range High: +125°C; Voltage Rating: 50 V; Mouser Description: Capacitor; Ceramic; Cap; 1000pF; Tol 10%; SMT; Vol-Rtg 50V; X7R; Tape and Reel; Category: Cap; ComponentLink2Description: Datasheet; Supplier 1: Arrow Electronics; Supplier Part Number 1: GRM1885C1H102JA01D
C15 C17 = CMP-13271-000010-1: CAP CER 100PF 50V C0G/NP0 0402; Manufacturer: Murata; Part Number: GCM1555C1H101JA16D; Material: Ceramic; Temperature Coefficient: 30ppm/°C; Capacitance: 100pF; ComponentLink2URL: http://www.samsungsem.com/global/front/downloadcms.do?path=%2F%2Fglobal%2F%2Fsupport%2F%2Fproduct-search%2F%2Fmlcc%2F%2F__icsFiles%2F%2Fafieldfile%2F%2F2019%2F%2F06%2F%2F18&fileName=CL05C101JB5NNNC-19.pdf; Temperature: -55°C to +125°C; Device Class L2: Capacitors; Digikey Description: CAP CER 100PF 50V C0G/NP0 0402; Value: 100pF; Temperature Range High: +125°C; Temperature Range Low: -55°C; ComponentLink2Description: Datasheet; Device Class L3: Ceramic Capacitors; Height: 0.55mm; Voltage Rating: 50V; Category: Cap; Supplier 1: Digikey; Supplier Part Number 1: 1276-1025-1-ND
U9 = HMC814LC3B: SMT GaAs MMIC x2 ACTIVE FREQUENCY / MULTIPLIER, 13 - 24.6 GHz OUTPUT; pin to pad: EPAD>13; Manufacturer: Analog Devices; RefDes: RefDes; Supplier 1: Mouser; Supplier Part Number 1: 584-HMC814LC3B; Part Number: HMC814LC3B

## Sheet power.SchDoc
size A; SheetNumber: 2; SheetTotal: 9
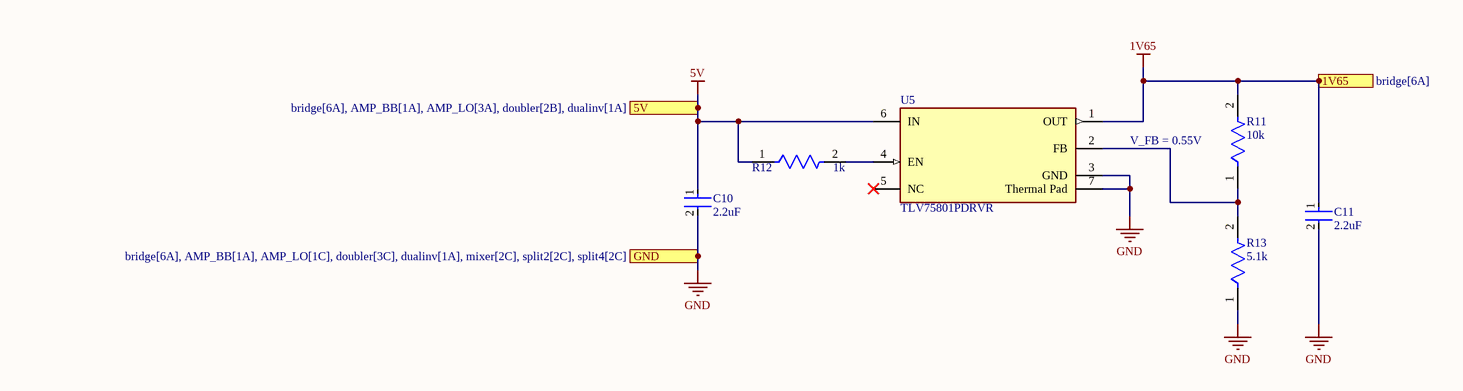
[diagram p6: power.SchDoc]

### Parts
C10  2.2uF  [FP-GRM188-0_1-e0_2_0_5-MFG]
C11  2.2uF  [FP-GRM188-0_1-e0_2_0_5-MFG]
R11  10k  [FP-RC0603-0_55-IPC_C]
R12  1k  [FP-ERJ3G-MFG]
R13  5.1k  [FP-CRCW0603-e3-IPC_C]
U5  TLV75801PDRVR  [FP-DRV0006A-MFG]

### Ports
1V65 (out, see bridge[6A]), 5V (see bridge[6A], AMP_BB[1A], AMP_LO[3A], doubler[2B], dualinv[1A]), GND (see bridge[6A], AMP_BB[1A], AMP_LO[1C], doubler[3C], dualinv[1A], mixer[2C], split2[2C], split4[2C])

### Nets
1V65: C11.1 R11.2 U5.1(OUT) ; port 1V65
5V: C10.1 R12.1 U5.6(IN) ; port 5V  [project net +5]
GND: C10.2 C11.2 R13.1 U5.3(GND) U5.7(Thermal_Pad) ; port GND
NetR11_1: R11.1 R13.2 U5.2(FB)
NetR12_2: R12.2 U5.4(EN)

Not connected (* = marked no-connect by the designer): U5 5(NC)*

### Notes on the sheet
- V_FB = 0.55V

### Library data of the parts
C10 C11 = CMP-2006-02836-2: Chip Multilayer Ceramic Capacitors for General Purpose, 0603, 2.2uF, X7R, 15%, 10%, 10V; Manufacturer: Murata; Part Number: GRM188R71A225KE15D; Case Code (Metric): 1608; Height: 0.8mm; Packaging: Cut Tape; Voltage: 10V; Lead Free: Lead Free; Min Operating Temperature: -55°C; Voltage Rating (DC): 10V; Max Operating Temperature: 125°C; Voltage Rating: 10V; Dielectric: X7R; Depth: 0.8mm; Case Code (Imperial): 0603; Termination: SMD/SMT; Case/Package: 0603; Number of Pins: 2; REACH SVHC: No SVHC; Mount: Surface Mount; Width: 0.031inch; Material: Ceramic; Capacitance: 2.2uF; Package Quantity: 1; Weight: 7.1E-05oz; Length: 1.6mm; Thickness: 0.035inch; Tolerance: 10%; Supplier 1: Arrow Electronics; Supplier Part Number 1: GRM188R71A225KE15D
R11 = CMP-2100-03664-2: as R5 on sheet bridge; Depth: 0.8mm; Termination: SMD/SMT; Resistor Type: Thick Film; Series: RC; Construction: Rectangular; Features: Moisture Resistant; Packaging: Tape and Reel; Min Operating Temperature: -55°C; Number of Terminations: 2; Lead Pitch: 0.3mm; RoHS Compliant: Yes; Case/Package: 0603; Resistance Tolerance: 1%; Military Standard: Not; Weight: 7.1E-05oz; Number of Pins: 2; Tolerance: 1%; Length: 1.6mm; Case Code (Imperial): 0603; Lead Free: Lead Free; Width: 0.8mm; Max Power Dissipation: 100mW; Height: 0.45mm; Max Operating Temperature: 155°C; Case Code (Metric): 1608; Size Code: 0603; Supplier 1: Mouser; Supplier Part Number 1: 667-ERJ-S03F1002V
R12 = CMP-2000-00703-2: RES SMD 1K OHM 5% 1/10W 0603; Manufacturer: Panasonic; Manufacturer Part Number: ERJ-3GEYJ102V; Resistance: 1000Ω; Voltage: 75 V; Power Rating: 0.1W; Temperature Coefficient: 200ppm/°C; Voltage Rating: 75V; Value: 1000Ω; Automotive Grade: Grade 0; Category: Res; Ipc Land Pattern Name: RESC16080X45; Mounting Type: surface mount; Automotive: Yes; Temperature: -55°C to +155°C; Lead Free: Yes; Footprint Url: https://industrial.panasonic.com/cdbs/www-data/pdf/RDA0000/DMA0000COL17.pdf; Tolerance: 5%; Device Class L1: Passive Components; Height: 0.55mm; Temperature Range Low: -55°C; RoHS: TRUE; Package: ERJ3G; Temperature Range High: +155°C; Digikey Description: RES SMD 1K OHM 5% 1/10W 0603; Series: ERJ; Device Class L2: Resistors; Device Class L3: Chip SMD Resistors; Mouser Description: Res Thick Film 0603 1K Ohm 5% 1/10W ±200ppm/°C Molded SMD Punched Carrier T/R; Composition: Thick Film; Part Number: ERJ-3GEYJ102V; Supplier 1: Future Electronics; Supplier Part Number 1: 6028511
R13 = CMP-1012-00590-3: as R1 on sheet bridge; Width: 0.85mm; Depth: 0.85mm; Military Standard: Not; Package Quantity: 5000; Case Code (Metric): 1608; Length: 1.55mm; Weight: 7.1E-05oz; Packaging: Tape and Reel; Temperature Coefficient: 100ppm/°C; Case Code (Imperial): 0603; Lead Free: Lead Free; Radiation Hardening: No; Contact Plating: Tin; Composition: Thick Film; Max Operating Temperature: 155°C; Termination: SMD/SMT; Case/Package: 0603; Min Operating Temperature: -55°C; Tolerance: 1%; Voltage Rating: 75V; Mount: Surface Mount; Height: 0.45mm; Supplier 1: Mouser; Supplier Part Number 1: 667-ERJ-3EKF5101V
U5 = CMP-04917-000312-1: IC REG LIN POS ADJ 500MA 6WSON; Manufacturer: Texas Instruments; Part Number: TLV75801PDRVR; Supplier 1: Mouser; Supplier Part Number 1: 595-TLV75801PDRVR

## Sheet dualinv.SchDoc
size A; SheetNumber: 9; SheetTotal: 9
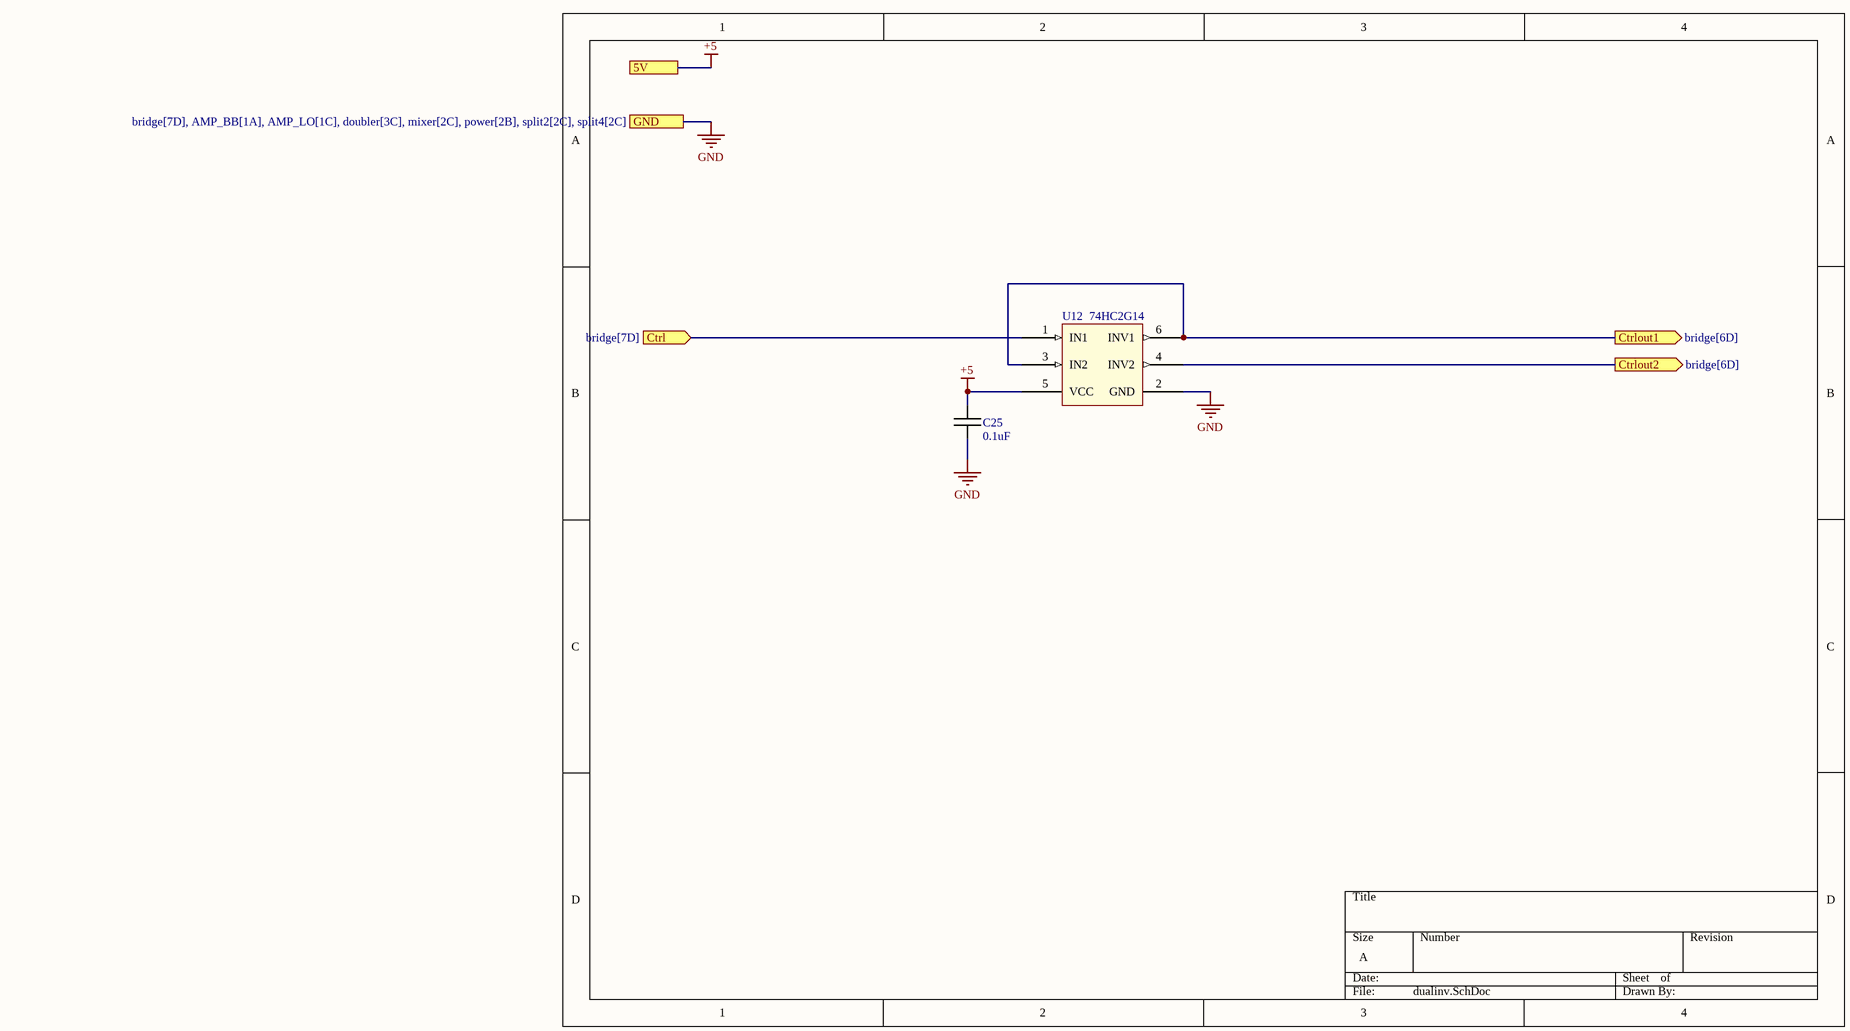
[diagram p7: dualinv.SchDoc]

### Parts
C25  0.1uF  [CAPC1608X90N]
U12  74HC2G14  [TSOP-6]

### Ports
5V (see bridge[7D], AMP_BB[1A], AMP_LO[3A], doubler[2B], power[2B]), Ctrl (in, see bridge[7D]), Ctrlout1 (out, see bridge[6D]), Ctrlout2 (out, see bridge[6D]), GND (see bridge[7D], AMP_BB[1A], AMP_LO[1C], doubler[3C], mixer[2C], power[2B], split2[2C], split4[2C])

### Nets
+5: C25.2 U12.5(VCC) ; port 5V
GND: C25.1 U12.2(GND) ; port GND
NetP1_2: U12.1(IN1) ; port Ctrl
NetR3_1: U12.3(IN2) U12.6(INV1) ; port Ctrlout1
NetR4_1: U12.4(INV2) ; port Ctrlout2

### Library data of the parts
C25 = GCM188L81H104KA57D: SMD Capacitor X8L(MURATA) with Capacitance: 0.10uF Tol. 10%. Rated Voltage: 50Vdc; Supplier 1: Mouser; Supplier Part Number 1: 81-GCM188L81H104KA7D; Manufacturer: Murata; Part Number: GCM188L81H104KA57D
U12 = 74HC2G14: Inverters Dual inverting Schmitt trigger, 2CH; Part Number: 74HC2G14GV; Manufacturer: Nexperia; Supplier 1: Digikey; Supplier Part Number 1: 1727-74HC2G14GV-Q100HCT-ND

## Sheet AMP_BB.SchDoc
size A; SheetNumber: 8; SheetTotal: 9
Used 2 times, as channels U_AMP_BB, U_AMP_BB. Parts and nets are listed once, with the designators drawn on the sheet.
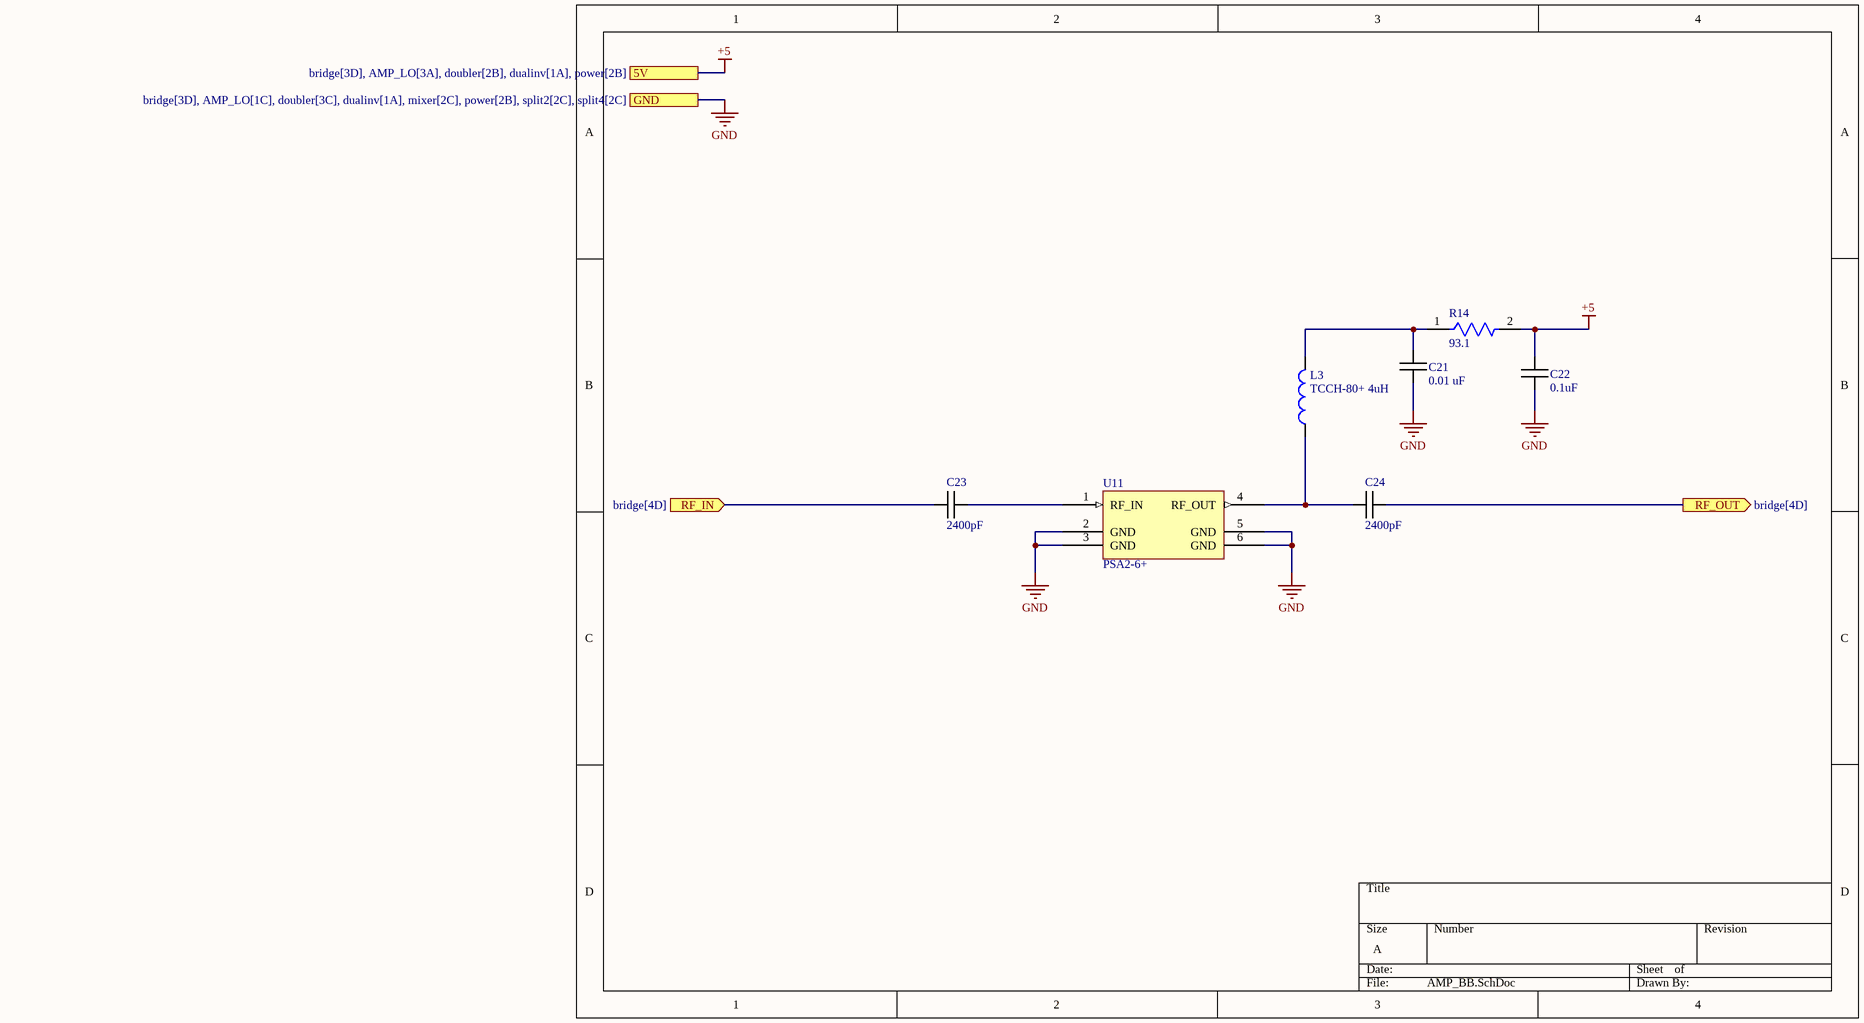
[diagram p8: AMP_BB.SchDoc]

### Parts
C21  0.01 uF  [CAP0603_10000pF]
C22  0.1uF  [CAPC1608X90N]
C23  2400pF  [CAPC1608X90N]
C24  2400pF  [CAPC1608X90N]
L3  TCCH-80+ 4uH  [TCCH-80+]
R14  93.1  [FP-CRCW0805-e3-MFG]
U11  PSA2-6+  [PSA2-6+ SOT-363]

### Ports
5V (see bridge[3D], AMP_LO[3A], doubler[2B], dualinv[1A], power[2B]), GND (see bridge[3D], AMP_LO[1C], doubler[3C], dualinv[1A], mixer[2C], power[2B], split2[2C], split4[2C]), RF_IN (in, see bridge[4D]), RF_OUT (out, see bridge[4D])

### Nets
+5: C22.2 R14.2 ; port 5V
GND: C21.1 C22.1 U11.2(GND) U11.3(GND) U11.5(GND) U11.6(GND) ; port GND
RF_IN: C23.1 ; port RF_IN
RF_OUT: C24.2 ; port RF_OUT
NetC21_2: C21.2 L3.3 R14.1
NetC23_2: C23.2 U11.1(RF_IN)
NetC24_1: C24.1 L3.1 U11.4(RF_OUT)

### Channels
U_AMP_BB: designators end in A; ports 5V=+5 GND=GND RF_IN=NetC23A_1 RF_OUT=NetC24A_2
U_AMP_BB: designators end in B; ports 5V=+5 GND=GND RF_IN=NetC23B_1 RF_OUT=NetC24B_2

### Library data of the parts
C21 = GCM1885C1H103JA16D: SMD Capacitor C0G(EIA) with Capacitance: 10000pF Tol. 5%. Rated Voltage: 50Vdc; Manufacturer: Murata; Part Number: GCM1885C1H103JA16D; Supplier 1: Mouser; Supplier Part Number 1: 81-GCM1885C1H103JA6D
C22 = GCM188L81H104KA57D: as C25 on sheet dualinv; Supplier 1: Mouser; Supplier Part Number 1: 81-GCM188L81H104KA7D; Manufacturer: Murata; Part Number: GCM188L81H104KA57D
C23 C24 = GCM1885C1H242FA16J: CAP CER 2400PF 50V C0G/NP0 0603; Manufacturer: Murata; Supplier 1: Mouser; Supplier Part Number 1: 81-GCM1885C1H242FA6J; Part Number: GCM1885C1H242FA16J
L3 = TCCH-80+: SMT RF Choke 50 MHz - 8.2 GHz, 50Ω; Manufacturer: Mini-Circuits; Part Number: TCCH-80+; Supplier 1: Digikey; Supplier Part Number 1: 3157-TCCH-80+CT-ND
R14 = CMP-2001-04168-2: RES Thick Film, 93.1Ω, 1%, 0.125W, 100ppm/°C, 0805; Part Number: ERJ-6ENF93R1V; Manufacturer: Panasonic; Resistance: 93.1R; Voltage Rating: 150V; Power Rating: 125mW; Tolerance: 1%; Features: Automotive AEC-Q200; Number of Terminations: 2; Case Code (Metric): 2012; Mount: Surface Mount; Case Code (Imperial): 0805; Temperature Coefficient: 100ppm/°C; Composition: Thick Film; Depth: 1.25mm; Case/Package: 0805; Width: 1.25mm; Voltage Rating (DC): 150V; Height: 0.02inch; Radiation Hardening: No; Contact Plating: Tin; Min Operating Temperature: -55°C; Max Power Dissipation: 125mW; Supplier 1: Digikey; Supplier Part Number 1: P93.1CCT-ND
U11 = PSA2-6+: SMT MMIC, Linear, Gain Block Amplifier, DC to 7000 MHz, 50Ω, SOT-363 Style Package; Manufacturer: Mini-Circuits; Supplier 1: Mouser; Supplier Part Number 1: 139-PSA2-6+; Part Number: PSA2-6+

## Nets that join several sheets
1V65: bridge (C9.1 FL1.3), power (C11.1 R11.2 U5.1)
+5: bridge (14 pins), AMP_LO (C18.1 C19.1 L1.2), doubler (8 pins), power (C10.1 R12.1 U5.6), dualinv (C25.2 U12.5), U_AMP_BB (C22A.2 R14A.2), U_AMP_BB (C22B.2 R14B.2)
GND: bridge (38 pins), split2 (30 pins), mixer (21 pins), split4 (28 pins), AMP_LO (12 pins), doubler (11 pins), power (5 pins), dualinv (C25.1 U12.2), U_AMP_BB (6 pins), U_AMP_BB (6 pins)
IF1IO: bridge (C4.1), mixer (U8.10)
IF2IO: bridge (C6.1), mixer (U8.12)
NetC1_1: bridge (C1.1), split2 (U6.12)
NetC1_2: bridge (C1.2), split4 (U7.31)
NetC2_1: bridge (C2.1), mixer (U8.16)
NetC2_2: bridge (C2.2), split4 (U7.10)
NetC20_2: AMP_LO (C20.2), doubler (U9.2)
NetC23A_1: bridge (U2.4), U_AMP_BB (C23A.1)
NetC23B_1: bridge (U4.6), U_AMP_BB (C23B.1)
NetC24A_2: bridge (U1.6), U_AMP_BB (C24A.2)
NetC24B_2: bridge (U3.4), U_AMP_BB (C24B.2)
NetFL1_1: bridge (FL1.1), split4 (U7.27)
NetJ2_1: bridge (J2.1), split4 (U7.21)
NetJ3_1: bridge (J3.1), split2 (U6.21)
NetJ5_1: bridge (J5.1), split4 (U7.14)
NetL2_1: split2 (U6.29), AMP_LO (L2.1 U10.2)
NetP1_2: bridge (P1.2 R5.1 R15.2), dualinv (U12.1)
NetR3_1: bridge (R3.1), dualinv (U12.3 U12.6)
NetR4_1: bridge (R4.1), dualinv (U12.4)
NetU8_23: mixer (U8.23), doubler (U9.8)

## Assembly variants
Main: not fitted P1 R6 R7 R8 R9 R15